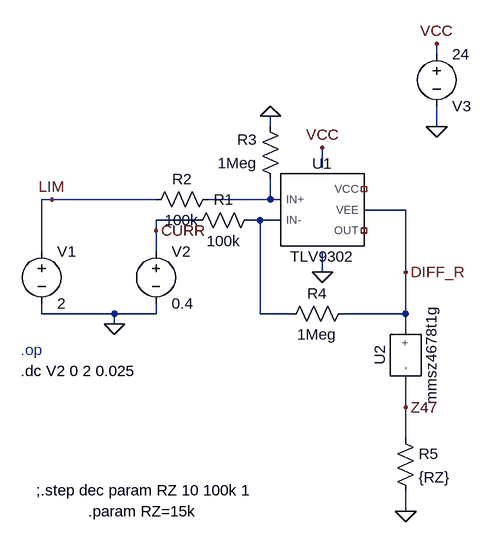
[diagram p0: schematic zener.asc]
zener.asc, the LTspice schematic file:
Version 4.1
SHEET 1 1016 984
WIRE 352 -80 352 -96
WIRE 96 32 96 16
WIRE 352 32 352 0
WIRE 176 96 176 64
WIRE -240 144 -256 144
WIRE -80 144 -240 144
WIRE 96 144 96 112
WIRE 96 144 0 144
WIRE 112 144 96 144
WIRE 304 160 240 160
WIRE -16 176 -80 176
WIRE 80 176 64 176
WIRE 112 176 80 176
WIRE -80 192 -80 176
WIRE -256 224 -256 144
WIRE -80 224 -80 192
WIRE 176 256 176 224
WIRE 304 256 304 160
WIRE -256 320 -256 304
WIRE -144 320 -256 320
WIRE -80 320 -80 304
WIRE -80 320 -144 320
WIRE 80 320 80 176
WIRE 128 320 80 320
WIRE 304 320 304 256
WIRE 304 320 208 320
WIRE -144 336 -144 320
WIRE 304 352 304 320
WIRE 304 464 304 416
WIRE 304 512 304 464
WIRE 304 624 304 592
FLAG -144 336 0
FLAG 96 16 0
FLAG 352 32 0
FLAG 176 256 0
FLAG -240 144 LIM
FLAG -80 192 CURR
FLAG 352 -96 VCC
FLAG 176 64 VCC
FLAG 304 256 DIFF_R
FLAG 304 464 Z47
FLAG 304 624 0
SYMBOL voltage -256 208 R0
WINDOW 123 0 0 Left 0
WINDOW 39 0 0 Left 0
SYMATTR InstName V1
SYMATTR Value 2
SYMBOL voltage -80 208 R0
WINDOW 123 0 0 Left 0
WINDOW 39 0 0 Left 0
SYMATTR InstName V2
SYMATTR Value 0.4
SYMBOL res 80 160 R90
WINDOW 0 0 56 VBottom 2
WINDOW 3 32 56 VTop 2
SYMATTR InstName R1
SYMATTR Value 100k
SYMBOL res 16 128 R90
WINDOW 0 0 56 VBottom 2
WINDOW 3 32 56 VTop 2
SYMATTR InstName R2
SYMATTR Value 100k
SYMBOL res 112 128 R180
WINDOW 0 36 76 Left 2
WINDOW 3 36 40 Left 2
SYMATTR InstName R3
SYMATTR Value 1Meg
SYMBOL res 224 304 R90
WINDOW 0 0 56 VBottom 2
WINDOW 3 32 56 VTop 2
SYMATTR InstName R4
SYMATTR Value 1Meg
SYMBOL voltage 352 -96 R0
WINDOW 0 24 96 Left 2
WINDOW 3 24 16 Left 2
WINDOW 123 0 0 Left 0
WINDOW 39 0 0 Left 0
SYMATTR InstName V3
SYMATTR Value 24
SYMBOL res 288 496 R0
SYMATTR InstName R5
SYMATTR Value {RZ}
SYMBOL mmsz4678t1g 304 384 R270
SYMATTR InstName U2
SYMBOL TLV9302 176 160 R0
SYMATTR InstName U1
TEXT -288 376 Left 2 ;.op
TEXT -288 408 Left 2 !.dc V2 0 2 0.025
TEXT -264 592 Left 2 !;.step dec param RZ 10 100k 1
TEXT -184 624 Left 2 !.param RZ=15k

The netlist it stands for:
* zener.asc
V1 LIM 0 2
V2 CURR 0 0.4
R1 N002 CURR 100k
R2 N001 LIM 100k
R3 N001 0 1Meg
R4 DIFF_R N002 1Meg
V3 VCC 0 24
R5 Z47 0 {RZ}
X§U2 Z47 DIFF_R mmsz4678t1g  ; pins - +
X§U1 N001 N002 NC_01 DIFF_R NC_02 TLV9302  ; pins IN+ IN- VCC VEE OUT
* .op
.dc V2 0 2 0.025
;.step dec param RZ 10 100k 1
.param RZ=15k
.lib C:\Users\Tachi\Documents\Nerd Shit\rm_electrical-supercap\SPICE_sims\libraries\MMSZ4678T1G.LIB
.lib .\libraries\tlv9302.lib
.backanno
.end